# EAGLE design Display (EAGLE 7.4.1)

## Sheet 1 of 2
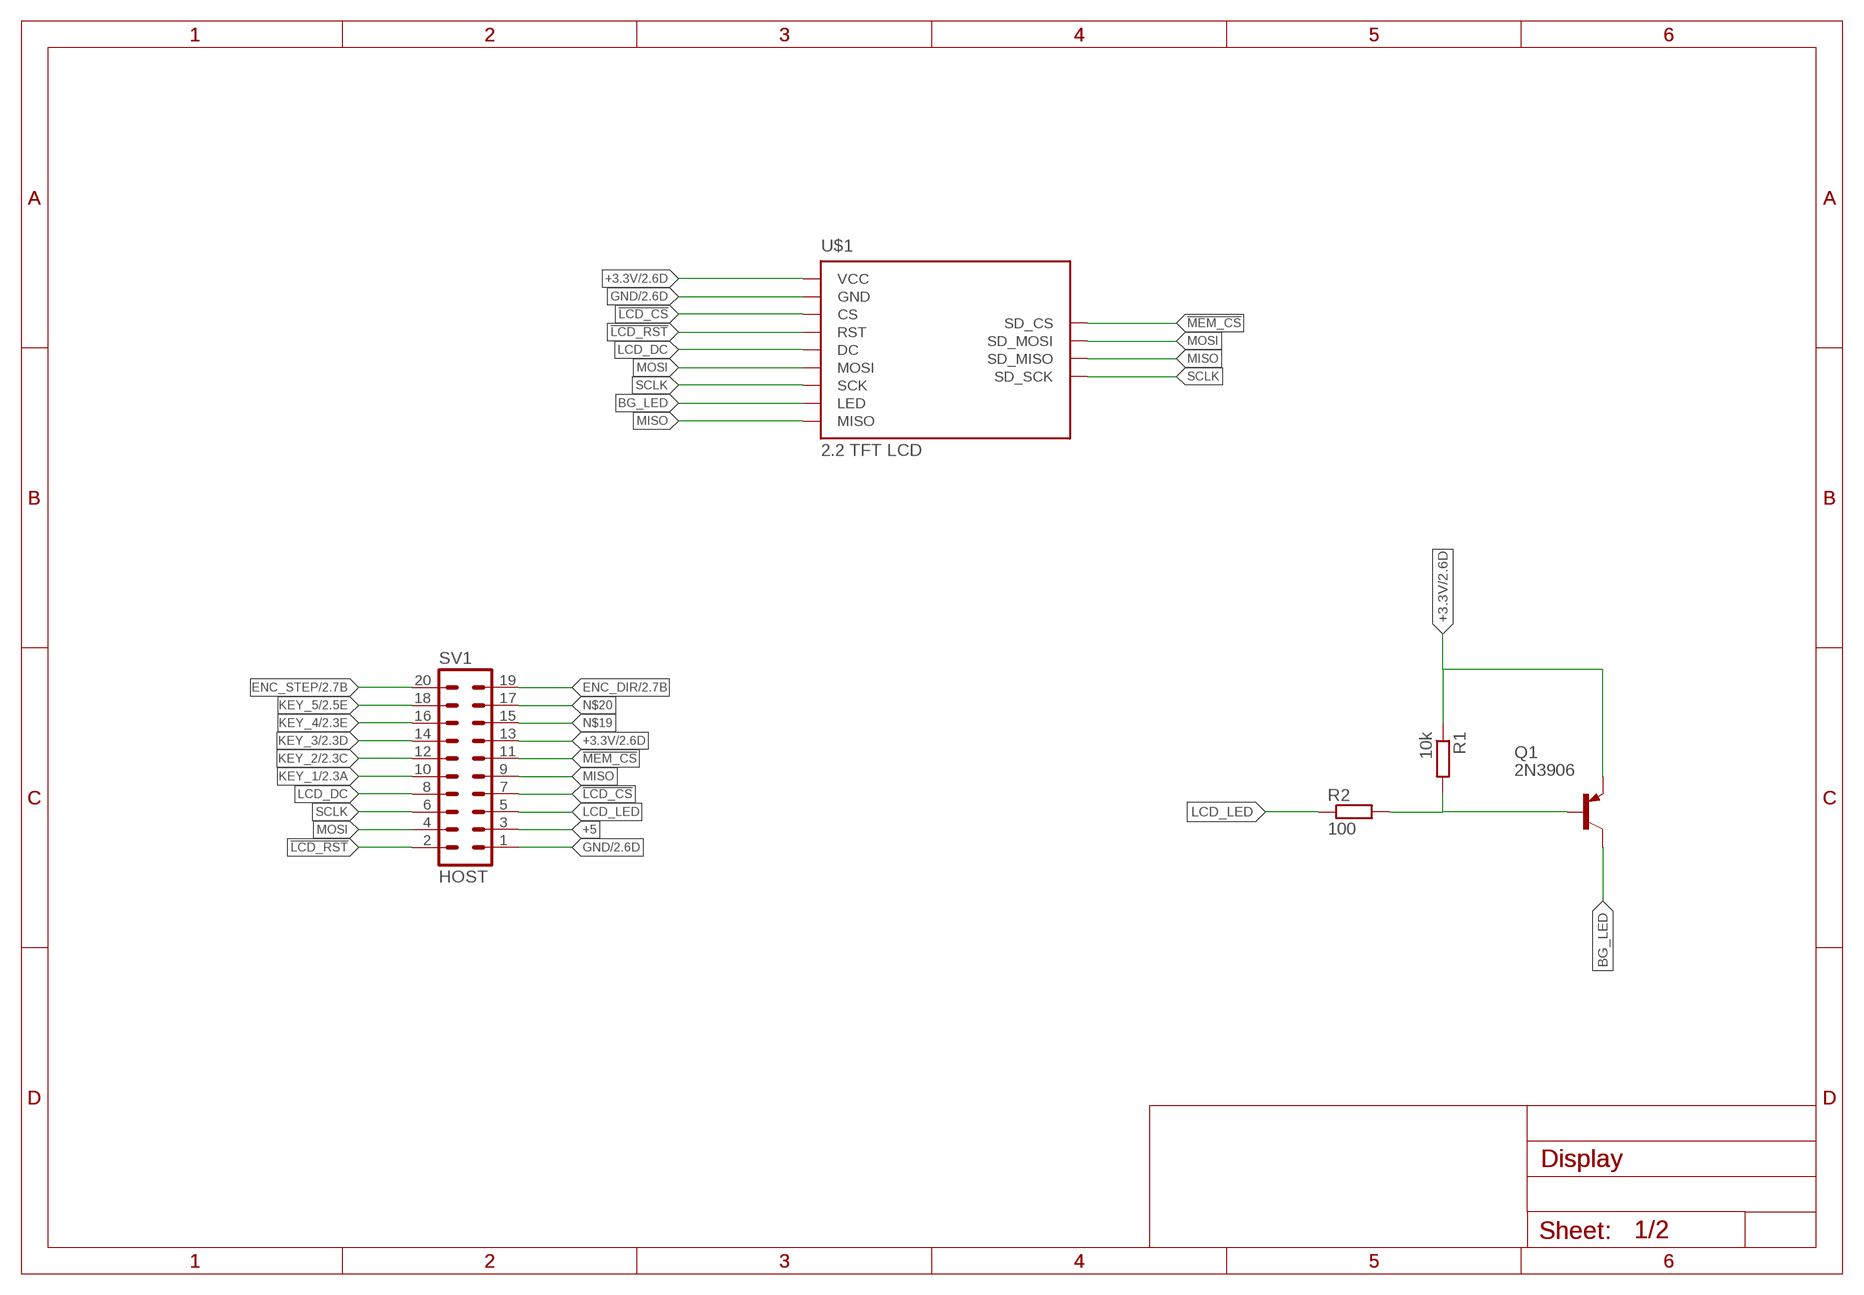
[diagram p0: schematic, sheet 1]

### Parts
Q1  2N3906  [TO92]
R1  10k  R-EU_0204/7  [0204/7]
R2  100  R-EU_0204/7  [0204/7]
SV1  HOST  ML20L  [ML20L]
U$1  2.2_TFT_LCD  [2.2_TFT_LCD]

### Nets
!LCD_CS: SV1.7 U$1.CS
!LCD_RST: SV1.2 U$1.RST
!MEM_CS: SV1.11 U$1.SD_CS
+3.3V [Supply]: Q1.3(E) R1.1 SV1.13 U$1.VCC ; also sheet 2
+5 [Supply]: SV1.3
BG_LED: Q1.1(C) U$1.LED
ENC_DIR: SV1.19 ; also sheet 2
ENC_STEP: SV1.20 ; also sheet 2
GND [Supply]: SV1.1 U$1.GND ; also sheet 2
KEY_1: SV1.10 ; also sheet 2
KEY_2: SV1.12 ; also sheet 2
KEY_3: SV1.14 ; also sheet 2
KEY_4: SV1.16 ; also sheet 2
KEY_5: SV1.18 ; also sheet 2
LCD_DC: SV1.8 U$1.DC
LCD_LED: R2.1 SV1.5
MISO: SV1.9 U$1.MISO U$1.SD_MISO
MOSI: SV1.4 U$1.MOSI U$1.SD_MOSI
N$2: Q1.2(B) R1.2 R2.2
N$19: SV1.15
N$20: SV1.17
SCLK: SV1.6 U$1.SCK U$1.SD_SCK

## Sheet 2 of 2: Debouncer Simple RC Schmitt-Trigger debouncer
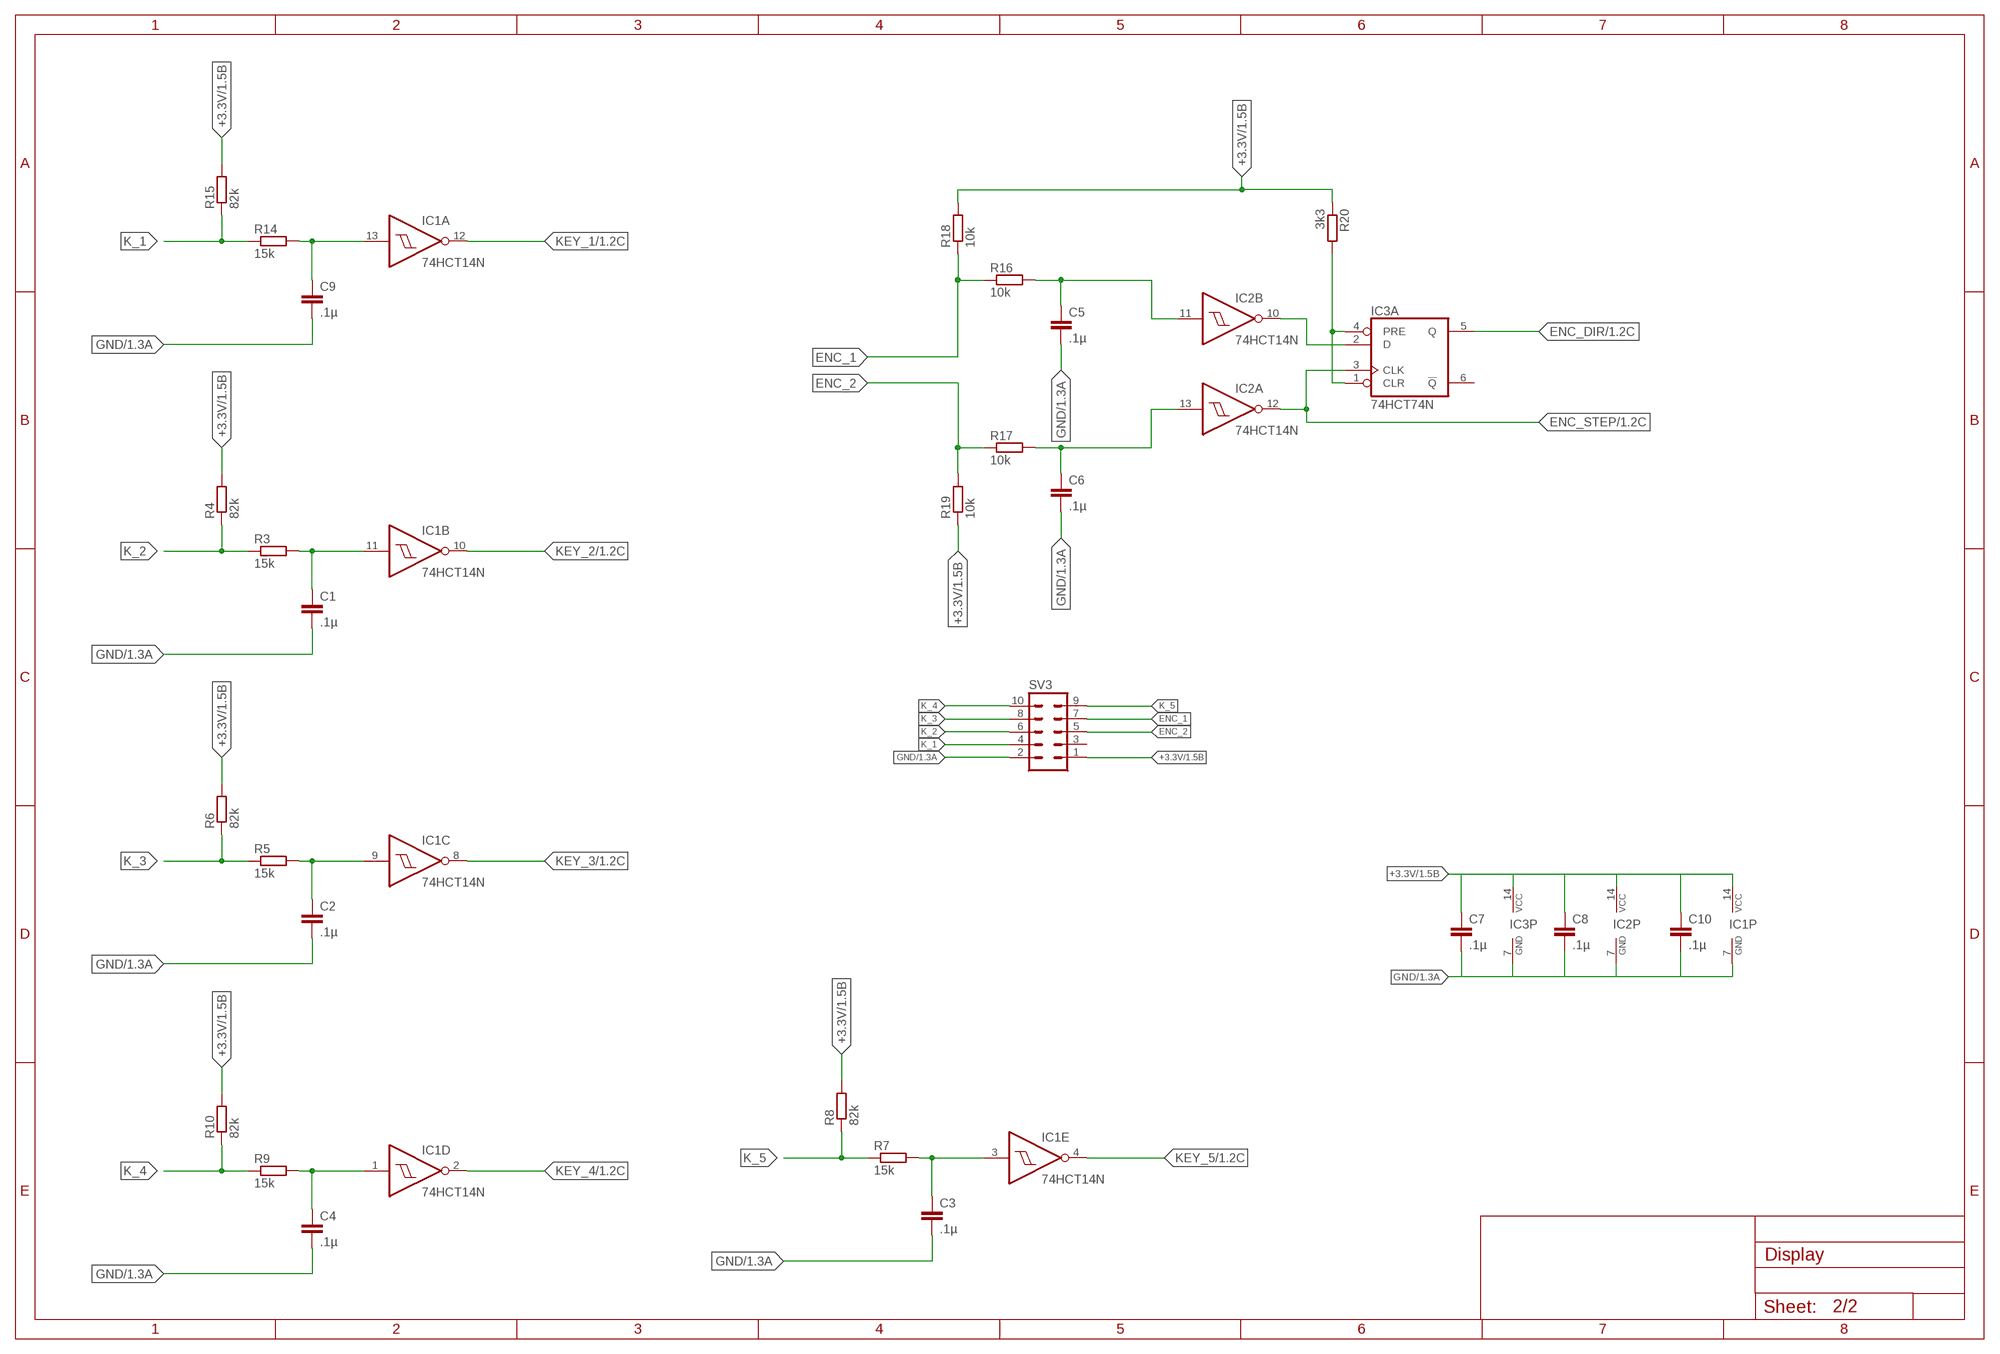
[diagram p1: schematic, sheet 2]

### Parts
C1  .1µ  C-EU025-024X044  [C025-024X044]
C2  .1µ  C-EU025-024X044  [C025-024X044]
C3  .1µ  C-EU025-024X044  [C025-024X044]
C4  .1µ  C-EU025-024X044  [C025-024X044]
C5  .1µ  C-EU025-024X044  [C025-024X044]
C6  .1µ  C-EU025-024X044  [C025-024X044]
C7  .1µ  C-EU025-024X044  [C025-024X044]
C8  .1µ  C-EU025-024X044  [C025-024X044]
C9  .1µ  C-EU025-024X044  [C025-024X044]
C10  .1µ  C-EU025-024X044  [C025-024X044]
IC1  74HCT14N  [DIL14]
IC2  74HCT14N  [DIL14]
IC3  74HCT74N  [DIL14]
R3  15k  R-EU_0204/7  [0204/7]
R4  82k  R-EU_0204/7  [0204/7]
R5  15k  R-EU_0204/7  [0204/7]
R6  82k  R-EU_0204/7  [0204/7]
R7  15k  R-EU_0204/7  [0204/7]
R8  82k  R-EU_0204/7  [0204/7]
R9  15k  R-EU_0204/7  [0204/7]
R10  82k  R-EU_0204/7  [0204/7]
R14  15k  R-EU_0204/7  [0204/7]
R15  82k  R-EU_0204/7  [0204/7]
R16  10k  R-EU_0204/7  [0204/7]
R17  10k  R-EU_0204/7  [0204/7]
R18  10k  R-EU_0204/7  [0204/7]
R19  10k  R-EU_0204/7  [0204/7]
R20  3k3  R-EU_0204/7  [0204/7]
SV3  ML10L  [ML10L]

### Nets
+3.3V [Supply]: C7.1 C8.1 C10.1 IC1.14(P:VCC) IC2.14(P:VCC) IC3.14(P:VCC) R4.2 R6.2 R8.2 R10.2 R15.2 R18.2 R19.1 R20.1 SV3.1 ; also sheet 1
ENC1: C5.1 IC2.11(B:I) R16.2
ENC2: C6.1 IC2.13(A:I) R17.2
ENC_1: R16.1 R18.1 SV3.7
ENC_2: R17.1 R19.2 SV3.5
ENC_DIR: IC3.5(A:Q) ; also sheet 1
ENC_STEP: IC2.12(A:O) IC3.3(A:CLK) ; also sheet 1
GND [Supply]: C1.2 C2.2 C3.2 C4.2 C5.2 C6.2 C7.2 C8.2 C9.2 C10.2 IC1.7(P:GND) IC2.7(P:GND) IC3.7(P:GND) SV3.2 ; also sheet 1
K1: C9.1 IC1.13(A:I) R14.2
K2: C1.1 IC1.11(B:I) R3.2
K3: C2.1 IC1.9(C:I) R5.2
K4: C3.1 IC1.3(E:I) R7.2
K5: C4.1 IC1.1(D:I) R9.2
K_1: R14.1 R15.1 SV3.4
K_2: R3.1 R4.1 SV3.6
K_3: R5.1 R6.1 SV3.8
K_4: R9.1 R10.1 SV3.10
K_5: R7.1 R8.1 SV3.9
KEY_1: IC1.12(A:O) ; also sheet 1
KEY_2: IC1.10(B:O) ; also sheet 1
KEY_3: IC1.8(C:O) ; also sheet 1
KEY_4: IC1.2(D:O) ; also sheet 1
KEY_5: IC1.4(E:O) ; also sheet 1
N$1: IC2.10(B:O) IC3.2(A:D)
N$3: IC3.1(A:CLR) IC3.4(A:PRE) R20.2
Unconnected: IC1.5(F:I) IC1.6(F:O) IC2.1(D:I) IC2.2(D:O) IC2.3(E:I) IC2.4(E:O) IC2.5(F:I) IC2.6(F:O) IC2.8(C:O) IC2.9(C:I) IC3.6(A:!Q) IC3.8(B:!Q) IC3.9(B:Q) IC3.10(B:PRE) IC3.11(B:CLK) IC3.12(B:D) IC3.13(B:CLR) SV3.3

## Library data of the parts
C1-C10 = rcl:C-EU: CAPACITOR, European symbol
IC1 IC2 = 74xx-eu:74*14: Hex schmitt trigger INVERTER
IC3 = 74xx-eu:74*74: Dual D type positive edge triggered FLIP FLOP, preset and clear
Q1 = transistor-pnp:2N3906: PNP Transistor
R1-R10 R14-R20 = resistor:R-EU_: RESISTOR, European symbol
SV1 = con-harting-ml:ML20: HARTING; OC_FARNELL: unknown; OC_NEWARK: unknown
SV3 = con-harting-ml:ML10: HARTING; OC_FARNELL: unknown; OC_NEWARK: unknown
U$1 = 2.2"tft:2.2_TFT_LCD

## Net classes
0 default: width 0.203 mm, drill 0.305 mm
1 Supply: width 0.406 mm, drill 0.305 mm

## Board
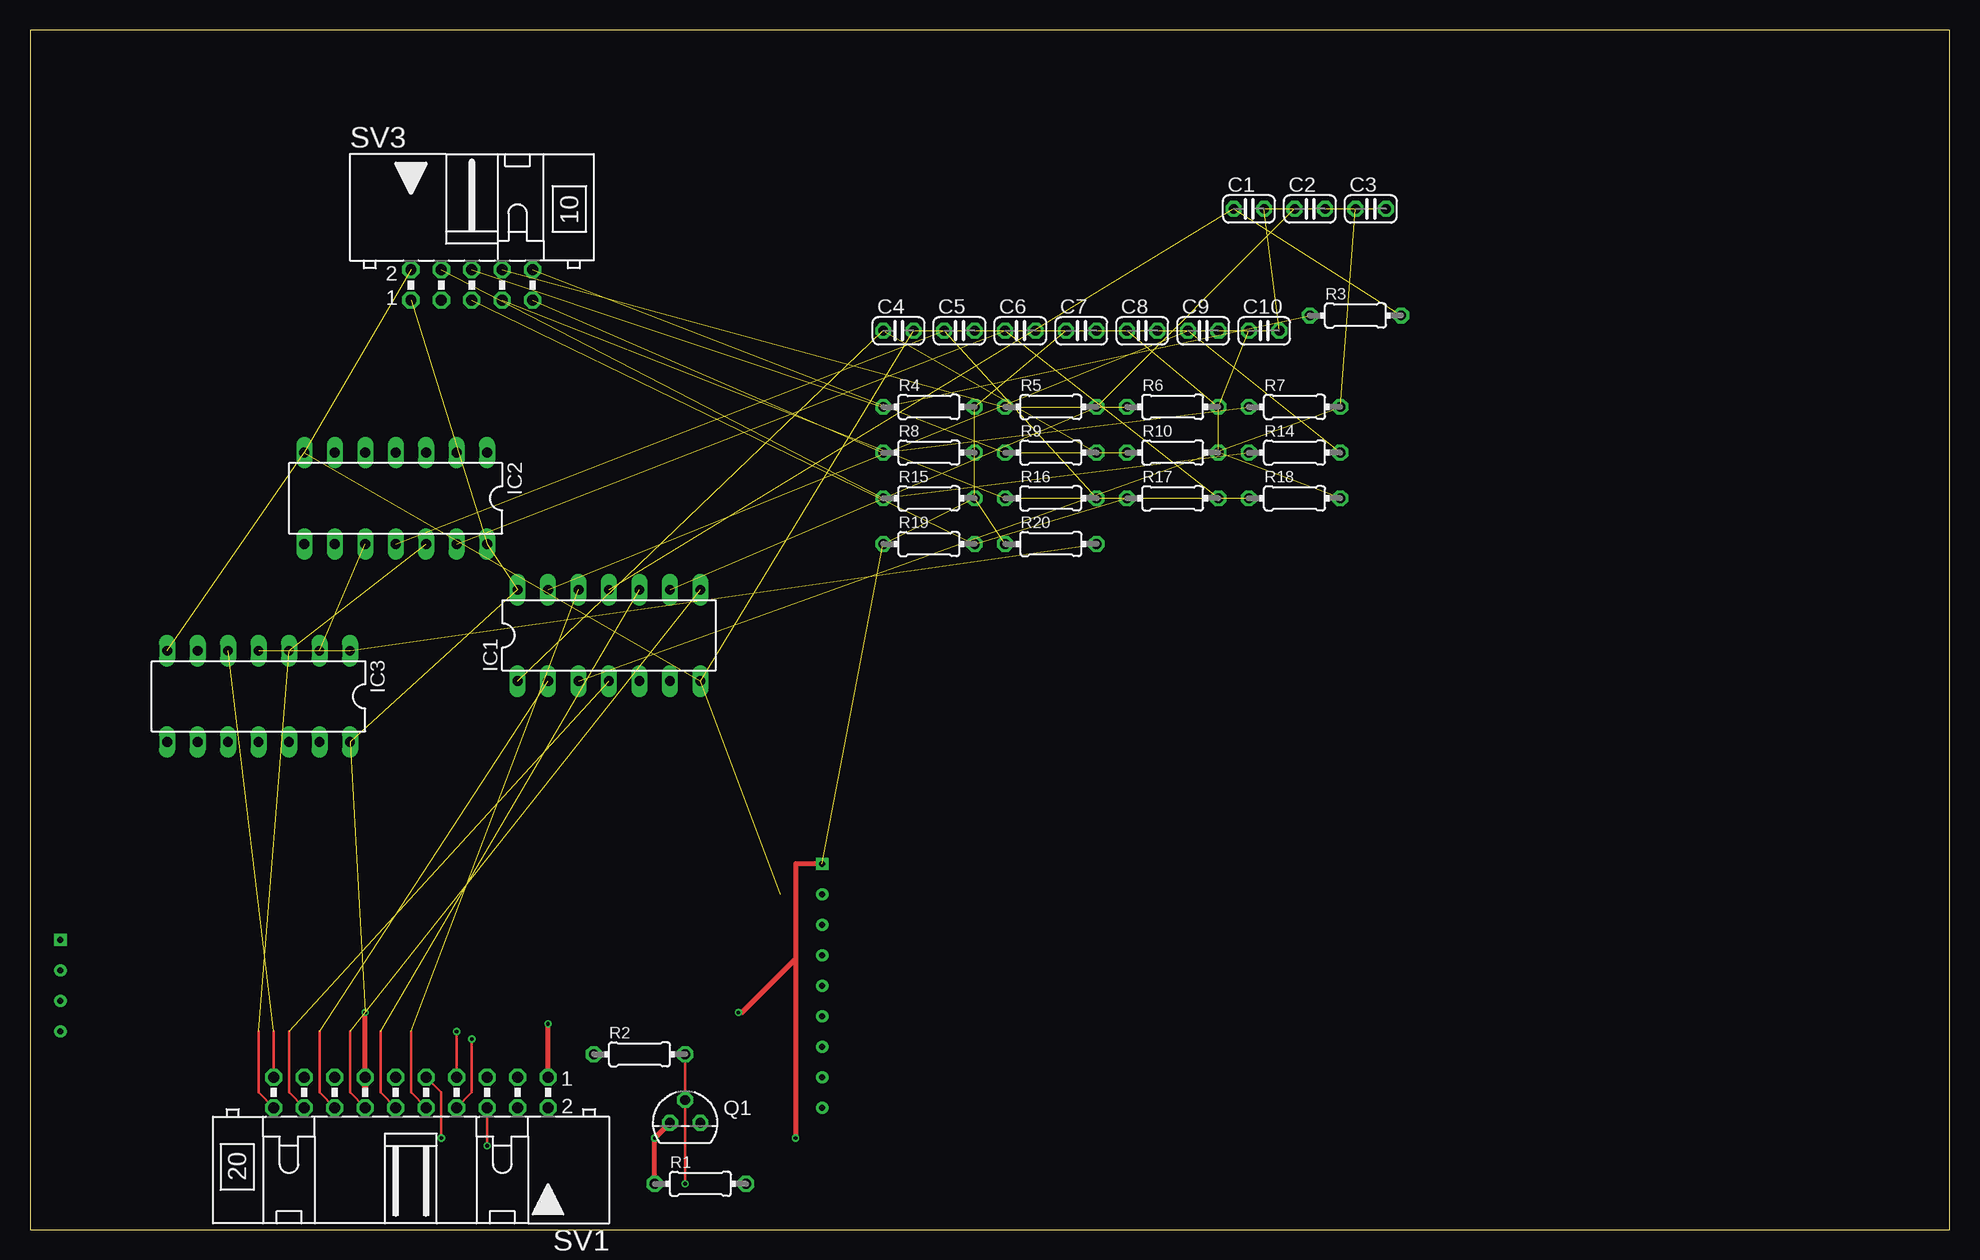
[diagram p2: board, top side]
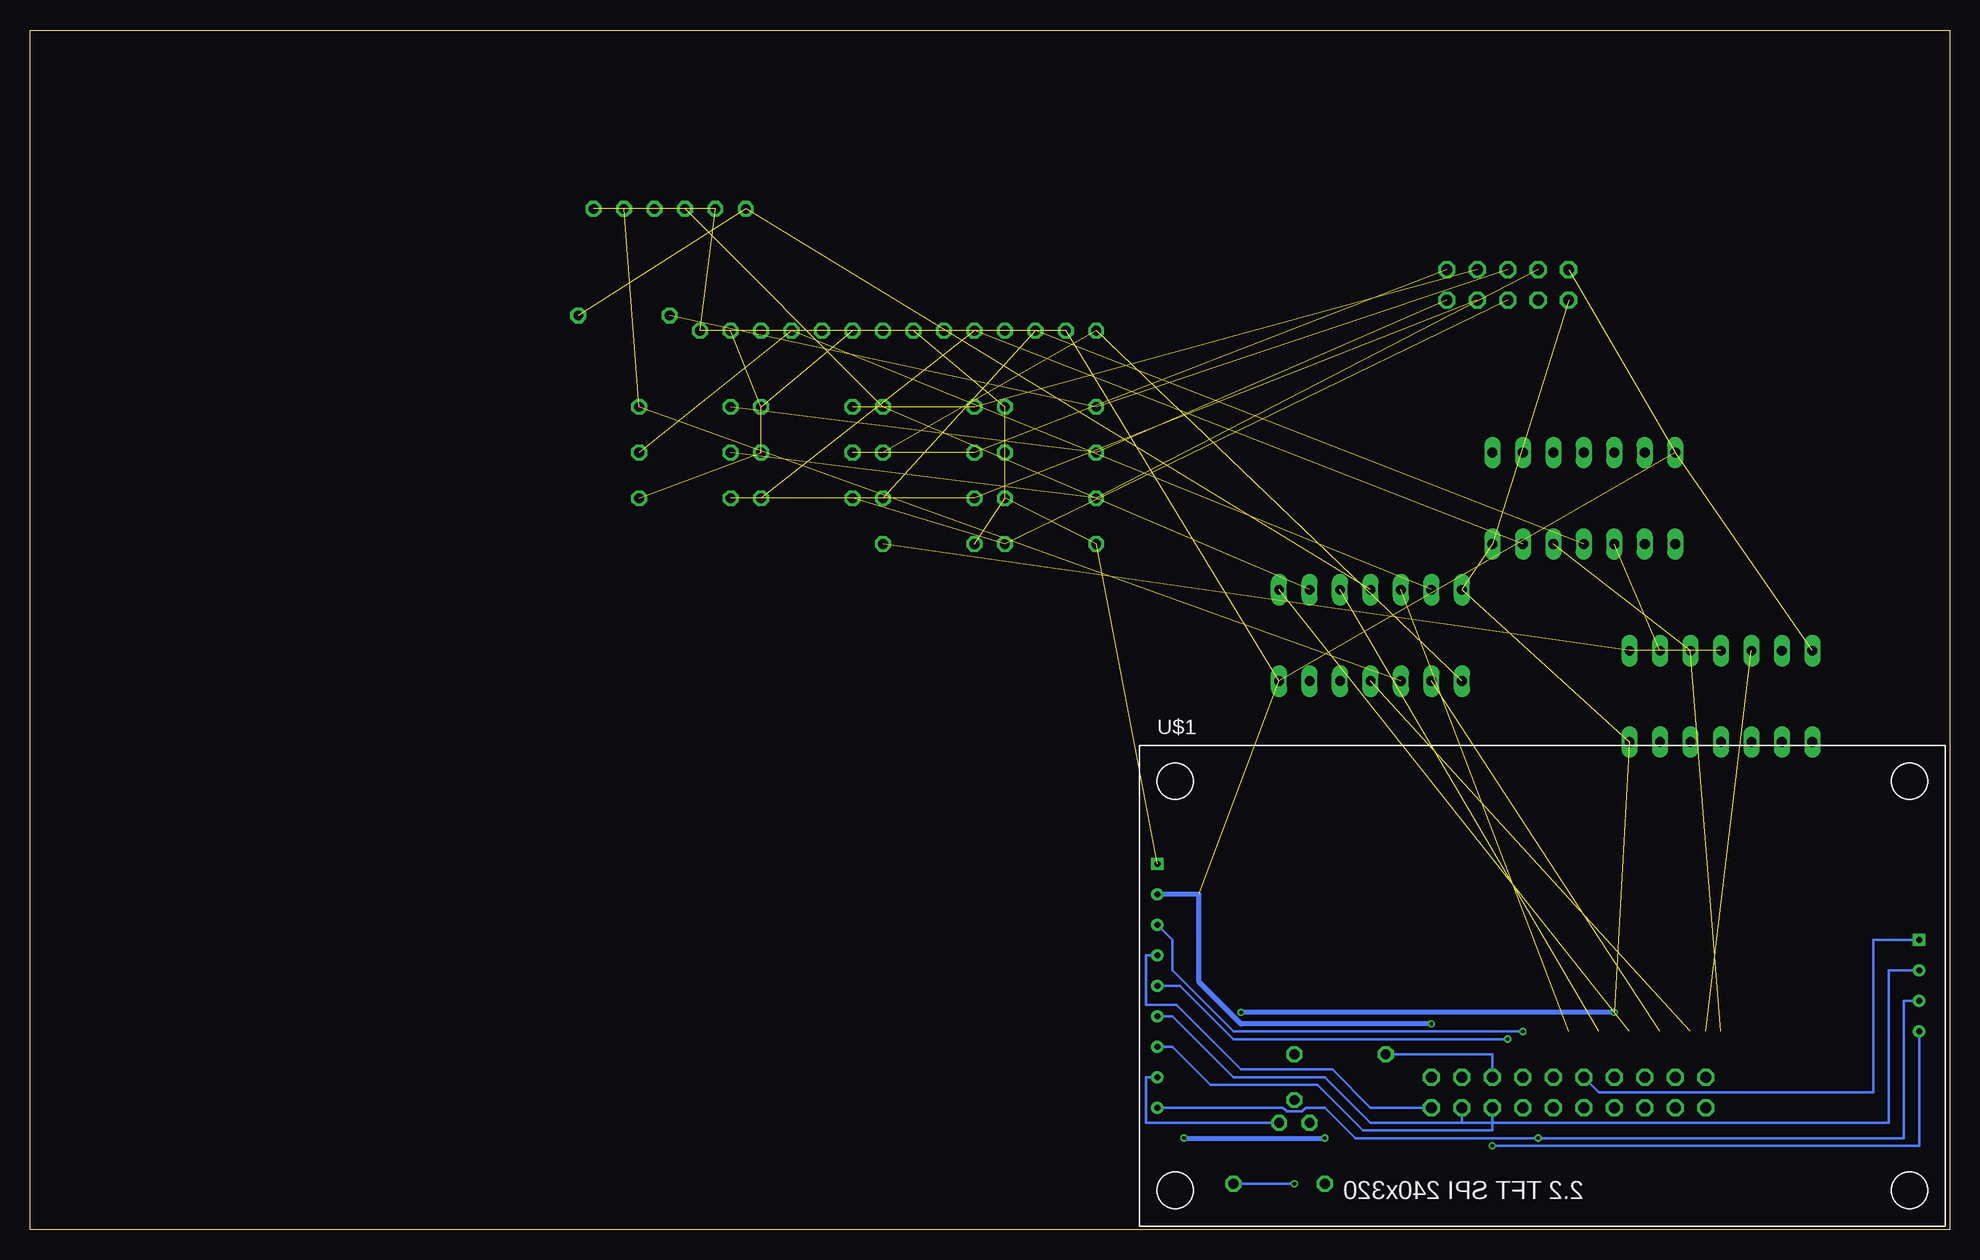
[diagram p3: board, bottom side, seen from below]

Size 160 x 100 mm. Coordinates in mm from the lower left corner, seen from the top.
Outline: 0,0 160,0 160,100 0,100 0,0
Copper layers (1*16): Top 0.035mm / dielectric 1.5mm / Bottom 0.035mm
Design rules "dirt_cheap_dirty_boards.v1": minimum track width 5mil, minimum drill 12mil, track to track 5mil, track to pad 5mil, pad to pad 5mil, via to via 5mil, smd to smd 0mil, copper to edge 10mil, drill to drill 10mil, minimum pad ring 10mil, minimum via ring 6mil, stop-mask expansion 2mil, vias tented up to drill 25mil, thermal gap 10mil

### Footprints (pad centres in the part's own frame; a part is rotated, then mirrored left to right if it is on the bottom)
C025-024X044 = drill 0.813 octagon: 1 -1.27,0; 2 1.27,0
DIL14 = drill 0.813 long: 1 -7.62,-3.81; 2 -5.08,-3.81; 3 -2.54,-3.81; 4 0,-3.81; 5 2.54,-3.81; 6 5.08,-3.81; 7 7.62,-3.81; 8 7.62,3.81; 9 5.08,3.81; 10 2.54,3.81; 11 0,3.81; 12 -2.54,3.81; 13 -5.08,3.81; 14 -7.62,3.81
TO92 = drill 0.813 octagon: 1 1.27,0; 2 0,1.905; 3 -1.27,0
0204/7 = drill 0.813 octagon: 1 -3.81,0; 2 3.81,0
ML20L = drill 0.914 octagon: 1 -11.43,-1.27; 2 -11.43,1.27; 3 -8.89,-1.27; 4 -8.89,1.27; 5 -6.35,-1.27; 6 -6.35,1.27; 7 -3.81,-1.27; 8 -3.81,1.27; 9 -1.27,-1.27; 10 -1.27,1.27; 11 1.27,-1.27; 12 1.27,1.27; 13 3.81,-1.27; 14 3.81,1.27; 15 6.35,-1.27; 16 6.35,1.27; 17 8.89,-1.27; 18 8.89,1.27; 19 11.43,-1.27; 20 11.43,1.27
ML10L = drill 0.914 octagon: 1 -5.08,-1.27; 2 -5.08,1.27; 3 -2.54,-1.27; 4 -2.54,1.27; 5 0,-1.27; 6 0,1.27; 7 2.54,-1.27; 8 2.54,1.27; 9 5.08,-1.27; 10 5.08,1.27
2.2_TFT_LCD = drill 0.5: CS 0,-5.08; DC 0,-10.16; GND 0,-2.54; LED 0,-17.78; MISO 0,-20.32; MOSI 0,-12.7; RST 0,-7.62; SCK 0,-15.24; SD_MISO 63.5,-11.43; SD_MOSI 63.5,-8.89; SD_SCK 63.5,-13.97 | drill 0.5 square: SD_CS 63.5,-6.35; VCC 0,0

### Placement (x,y rotation side)
C1  101.6,85.09 0 top
C2  106.68,85.09 0 top
C3  111.76,85.09 0 top
C4  72.39,74.93 0 top
C5  77.47,74.93 0 top
C6  82.55,74.93 0 top
C7  87.63,74.93 0 top
C8  92.71,74.93 0 top
C9  97.79,74.93 0 top
C10  102.87,74.93 0 top
IC1  48.26,49.53 0 top
IC2  30.48,60.96 180 top
IC3  19.05,44.45 180 top
Q1  54.61,8.89 0 top
R1  55.88,3.81 0 top
R2  50.8,14.61 0 top
R3  110.49,76.2 0 top
R4  74.93,68.58 0 top
R5  85.09,68.58 0 top
R6  95.25,68.58 0 top
R7  105.41,68.58 0 top
R8  74.93,64.77 0 top
R9  85.09,64.77 0 top
R10  95.25,64.77 0 top
R14  105.41,64.77 0 top
R15  74.93,60.96 0 top
R16  85.09,60.96 0 top
R17  95.25,60.96 0 top
R18  105.41,60.96 0 top
R19  74.93,57.15 0 top
R20  85.09,57.15 0 top
SV1  31.75,11.43 180 top
SV3  36.83,78.74 0 top
U$1  66.04,30.48 0 bottom

### Tracks (layer width: path | path; a pad name or v marks a point on that pad's centre or on a via)
!LCD_CS  (via drill 0.3 pad 0.25)
  Top 0.203: SV1.7 v35.56,16.51
  Bottom 0.203: v35.56,16.51 59.69,16.51 64.77,21.59 64.77,24.13 U$1.CS
!LCD_RST
  Bottom 0.203: SV1.2 48.26,10.16 51.44,13.34 59.05,13.34 64.45,18.73 66.99,18.73 66.99,22.86 U$1.RST
!MEM_CS
  Bottom 0.203: U$1.SD_CS 6.35,24.13 6.35,11.43 29.21,11.43 SV1.11
+3.3V  (via drill 0.3, 0.3 pad 0.25)  (15 unrouted)
  Top 0.406: SV1.13 v27.94,18.1 | R1.1 v52.07,7.62 Q1.3 | U$1.VCC 63.82,30.48 63.82,22.54 | 63.82,22.54 v63.82,7.62 | v59.05,18.1 59.37,18.1 63.82,22.54
  Top 0.61: SV1.13 27.94,12.06
  Bottom 0.406: v63.82,7.62 v52.07,7.62 | v27.94,18.1 v59.05,18.1
BG_LED
  Bottom 0.203: U$1.LED 66.99,12.7 66.99,8.89 Q1.1
ENC1  (2 unrouted)
ENC2  (2 unrouted)
ENC_1  (2 unrouted)
ENC_2  (2 unrouted)
ENC_DIR  (1 unrouted)
  Top 0.203: SV1.19 20.32,16.51
ENC_STEP  (2 unrouted)
  Top 0.203: SV1.20 19.05,11.43 19.05,16.51
GND  (via drill 0.3 pad 0.25)  (14 unrouted)
  Top 0.406: SV1.1 v43.18,17.14
  Bottom 0.406: v43.18,17.14 59.05,17.14 62.55,20.64 62.55,27.94 U$1.GND
K1  (2 unrouted)
K2  (2 unrouted)
K3  (2 unrouted)
K4  (2 unrouted)
K5  (2 unrouted)
K_1  (2 unrouted)
K_2  (2 unrouted)
K_3  (2 unrouted)
K_4  (2 unrouted)
K_5  (2 unrouted)
KEY_1  (1 unrouted)
  Top 0.203: SV1.10 31.75,11.43 31.75,16.51
KEY_2  (1 unrouted)
  Top 0.203: SV1.12 29.21,11.43 29.21,16.51
KEY_3  (1 unrouted)
  Top 0.203: SV1.14 26.67,11.43 26.67,16.51
KEY_4  (1 unrouted)
  Top 0.203: SV1.16 24.13,11.43 24.13,16.51
KEY_5  (1 unrouted)
  Top 0.203: SV1.18 21.59,11.43 21.59,16.51
LCD_DC  (via drill 0.3 pad 0.25)
  Top 0.203: SV1.8 36.83,11.43 v36.83,15.88
  Bottom 0.203: U$1.DC 64.14,20.32 59.69,15.88 v36.83,15.88
LCD_LED
  Bottom 0.203: R2.1 38.1,14.61 SV1.5
MISO  (via drill 0.3 pad 0.25)
  Top 0.203: SV1.9 34.29,11.43 v34.29,7.62
  Bottom 0.203: U$1.SD_MISO 3.81,19.05 3.81,7.62 v34.29,7.62 49.53,7.62 52.07,10.16 53.66,10.16 53.98,9.84 55.24,9.84 55.56,10.16 U$1.MISO
MOSI
  Bottom 0.203: U$1.SD_MOSI 5.08,21.59 5.08,8.89 40.64,8.89 | 40.64,8.89 48.26,8.89 52.07,12.7 59.69,12.7 64.77,17.78 U$1.MOSI | SV1.4 40.64,8.89
N$1  (1 unrouted)
N$2  (via drill 0.3)
  Top 0.203: v54.61,3.81 Q1.2 R2.2
  Bottom 0.203: R1.2 v54.61,3.81
N$3  (2 unrouted)
SCLK  (via drill 0.3 pad 0.25)
  Top 0.203: v38.1,6.99 SV1.6
  Bottom 0.203: U$1.SD_SCK 2.54,6.99 v38.1,6.99 | U$1.SCK 64.77,15.24 61.59,12.06 52.7,12.06 48.9,8.26 38.1,8.26 SV1.6